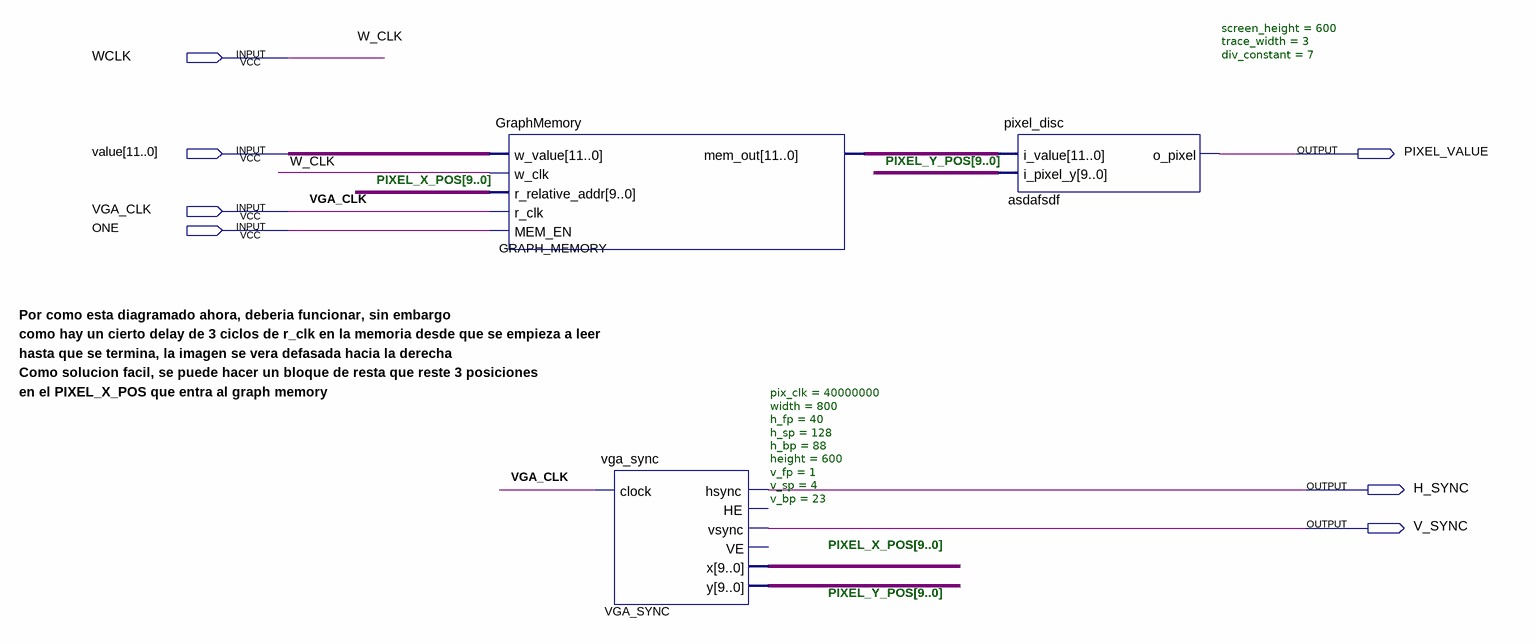
[diagram p0: schematic sheet]
// Quartus schematic Graphiker.bdf as structural Verilog: 3 symbols, 7 pins
module Graphiker (
  input  WCLK,
  input  [11:0] value,
  input  VGA_CLK,
  input  ONE,
  output PIXEL_VALUE,
  output H_SYNC,
  output V_SYNC
);

  wire [9:0] PIXEL_X_POS, PIXEL_Y_POS;
  wire [11:0] GRAPH_MEMORY_mem_out;

  GraphMemory GRAPH_MEMORY (
    .w_value(value), .w_clk(WCLK), .r_relative_addr(PIXEL_X_POS), .r_clk(VGA_CLK), .MEM_EN(ONE),
    .mem_out(GRAPH_MEMORY_mem_out));
  vga_sync #(.pix_clk(40000000), .width(800), .h_fp(40), .h_sp(128), .h_bp(88), .height(600), .v_fp(1), .v_sp(4), .v_bp(23)) VGA_SYNC (
    .clock(VGA_CLK), .hsync(H_SYNC), .vsync(V_SYNC), .x(PIXEL_X_POS), .y(PIXEL_Y_POS));  // open: HE, VE
  pixel_disc #(.screen_height(600), .trace_width(3), .div_constant(7)) asdafsdf (
    .i_value(GRAPH_MEMORY_mem_out), .i_pixel_y(PIXEL_Y_POS), .o_pixel(PIXEL_VALUE));

  // Other names for the same wires on the sheet: W_CLK = WCLK

  // Notes on the sheet:
  //   Por como esta diagramado ahora, deberia funcionar, sin embargo
  //   como hay un cierto delay de 3 ciclos de r_clk en la memoria desde que se empieza a leer
  //   hasta que se termina, la imagen se vera defasada hacia la derecha
  //   Como solucion facil, se puede hacer un bloque de resta que reste 3 posiciones
  //   en el PIXEL_X_POS que entra al graph memory
endmodule
